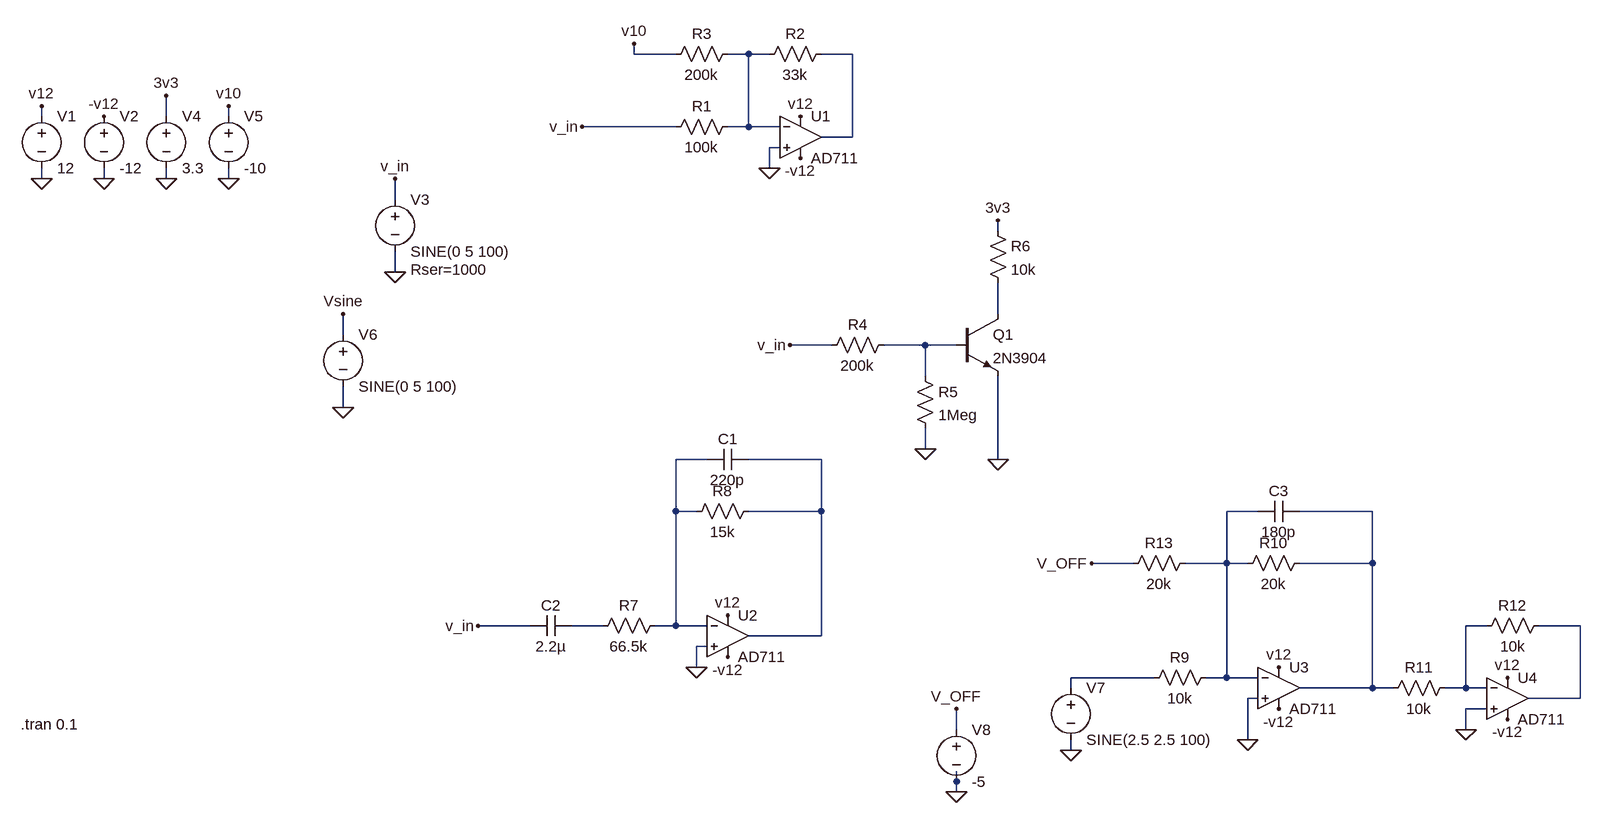
[diagram p0: schematic Interface.asc]
Interface.asc, the LTspice schematic file:
Version 4.1
SHEET 1 1508 1188
WIRE 48 32 48 16
WIRE 112 32 48 32
WIRE 224 32 192 32
WIRE 256 32 224 32
WIRE 384 32 336 32
WIRE -864 128 -864 112
WIRE -672 128 -672 96
WIRE -576 128 -576 112
WIRE 112 144 -32 144
WIRE 224 144 224 32
WIRE 224 144 192 144
WIRE 272 144 224 144
WIRE 384 160 384 32
WIRE 384 160 336 160
WIRE 272 176 256 176
WIRE 256 208 256 176
WIRE -864 224 -864 208
WIRE -768 224 -768 208
WIRE -672 224 -672 208
WIRE -576 224 -576 208
WIRE -320 256 -320 224
WIRE 608 304 608 288
WIRE -320 368 -320 336
WIRE 608 432 608 384
WIRE -400 464 -400 432
WIRE 352 480 288 480
WIRE 496 480 432 480
WIRE 544 480 496 480
WIRE 496 528 496 480
WIRE -400 576 -400 544
WIRE 496 640 496 608
WIRE 160 656 112 656
WIRE 336 656 224 656
WIRE 608 656 608 528
WIRE 112 736 112 656
WIRE 144 736 112 736
WIRE 336 736 336 656
WIRE 336 736 224 736
WIRE 1008 736 960 736
WIRE 1184 736 1072 736
WIRE 816 816 752 816
WIRE 960 816 960 736
WIRE 960 816 896 816
WIRE 992 816 960 816
WIRE 1184 816 1184 736
WIRE 1184 816 1072 816
WIRE -112 912 -192 912
WIRE 0 912 -48 912
WIRE 112 912 112 736
WIRE 112 912 80 912
WIRE 160 912 112 912
WIRE 1360 912 1328 912
WIRE 1504 912 1440 912
WIRE 336 928 336 736
WIRE 336 928 224 928
WIRE 160 944 144 944
WIRE 144 976 144 944
WIRE 848 992 720 992
WIRE 960 992 960 816
WIRE 960 992 928 992
WIRE 1008 992 960 992
WIRE 720 1008 720 992
WIRE 1184 1008 1184 816
WIRE 1184 1008 1072 1008
WIRE 1216 1008 1184 1008
WIRE 1328 1008 1328 912
WIRE 1328 1008 1296 1008
WIRE 1360 1008 1328 1008
WIRE 1008 1024 992 1024
WIRE 1504 1024 1504 912
WIRE 1504 1024 1424 1024
WIRE 1360 1040 1328 1040
WIRE 544 1072 544 1040
WIRE 1328 1072 1328 1040
WIRE 992 1088 992 1024
WIRE 720 1104 720 1088
WIRE 544 1152 544 1136
WIRE 544 1168 544 1152
FLAG -864 224 0
FLAG -768 224 0
FLAG -320 368 0
FLAG -864 112 v12
FLAG 304 128 v12
FLAG -768 128 -v12
FLAG 304 192 -v12
FLAG -672 224 0
FLAG -672 96 3v3
FLAG 608 288 3v3
FLAG 256 208 0
FLAG -576 224 0
FLAG -576 112 v10
FLAG 48 16 v10
FLAG -320 224 v_in
FLAG -32 144 v_in
FLAG 496 640 0
FLAG 608 656 0
FLAG 288 480 v_in
FLAG 192 896 v12
FLAG 192 960 -v12
FLAG 144 976 0
FLAG -192 912 v_in
FLAG -400 576 0
FLAG -400 432 Vsine
FLAG 1040 976 v12
FLAG 1040 1040 -v12
FLAG 720 1104 0
FLAG 1392 992 v12
FLAG 1392 1056 -v12
FLAG 1328 1072 0
FLAG 544 1168 0
FLAG 544 1040 V_OFF
FLAG 992 1088 0
FLAG 752 816 V_OFF
SYMBOL OpAmps\\AD711 304 96 R0
SYMATTR InstName U1
SYMBOL npn 544 432 R0
SYMATTR InstName Q1
SYMATTR Value 2N3904
SYMBOL res 208 128 R90
WINDOW 0 0 56 VBottom 2
WINDOW 3 32 56 VTop 2
SYMATTR InstName R1
SYMATTR Value 100k
SYMBOL res 352 16 R90
WINDOW 0 0 56 VBottom 2
WINDOW 3 32 56 VTop 2
SYMATTR InstName R2
SYMATTR Value 33k
SYMBOL res 208 16 R90
WINDOW 0 0 56 VBottom 2
WINDOW 3 32 56 VTop 2
SYMATTR InstName R3
SYMATTR Value 200k
SYMBOL voltage -864 112 R0
WINDOW 123 0 0 Left 0
WINDOW 39 0 0 Left 0
SYMATTR InstName V1
SYMATTR Value 12
SYMBOL voltage -768 112 R0
WINDOW 123 0 0 Left 0
WINDOW 39 0 0 Left 0
SYMATTR InstName V2
SYMATTR Value -12
SYMBOL voltage -320 240 R0
WINDOW 123 0 0 Left 0
WINDOW 39 24 124 Left 2
SYMATTR SpiceLine Rser=1000
SYMATTR InstName V3
SYMATTR Value SINE(0 5 100)
SYMBOL voltage -672 112 R0
WINDOW 123 0 0 Left 0
WINDOW 39 0 0 Left 0
SYMATTR InstName V4
SYMATTR Value 3.3
SYMBOL voltage -576 112 R0
WINDOW 123 0 0 Left 0
WINDOW 39 0 0 Left 0
SYMATTR InstName V5
SYMATTR Value -10
SYMBOL res 448 464 R90
WINDOW 0 0 56 VBottom 2
WINDOW 3 32 56 VTop 2
SYMATTR InstName R4
SYMATTR Value 200k
SYMBOL res 480 512 R0
SYMATTR InstName R5
SYMATTR Value 1Meg
SYMBOL res 592 288 R0
SYMATTR InstName R6
SYMATTR Value 10k
SYMBOL OpAmps\\AD711 192 864 R0
SYMATTR InstName U2
SYMBOL res 96 896 R90
WINDOW 0 0 56 VBottom 2
WINDOW 3 32 56 VTop 2
SYMATTR InstName R7
SYMATTR Value 66.5k
SYMBOL res 240 720 R90
WINDOW 0 0 56 VBottom 2
WINDOW 3 32 56 VTop 2
SYMATTR InstName R8
SYMATTR Value 15k
SYMBOL cap 224 640 R90
WINDOW 0 0 32 VBottom 2
WINDOW 3 32 32 VTop 2
SYMATTR InstName C1
SYMATTR Value 220p
SYMBOL cap -48 896 R90
WINDOW 0 0 32 VBottom 2
WINDOW 3 32 32 VTop 2
SYMATTR InstName C2
SYMATTR Value 2.2µ
SYMBOL voltage -400 448 R0
WINDOW 123 0 0 Left 0
WINDOW 39 0 0 Left 0
SYMATTR InstName V6
SYMATTR Value SINE(0 5 100)
SYMBOL OpAmps\\AD711 1040 944 R0
SYMATTR InstName U3
SYMBOL res 944 976 R90
WINDOW 0 0 56 VBottom 2
WINDOW 3 32 56 VTop 2
SYMATTR InstName R9
SYMATTR Value 10k
SYMBOL res 1088 800 R90
WINDOW 0 0 56 VBottom 2
WINDOW 3 32 56 VTop 2
SYMATTR InstName R10
SYMATTR Value 20k
SYMBOL cap 1072 720 R90
WINDOW 0 0 32 VBottom 2
WINDOW 3 32 32 VTop 2
SYMATTR InstName C3
SYMATTR Value 180p
SYMBOL voltage 720 992 R0
WINDOW 123 0 0 Left 0
WINDOW 39 0 0 Left 0
SYMATTR InstName V7
SYMATTR Value SINE(2.5 2.5 100)
SYMBOL OpAmps\\AD711 1392 960 R0
SYMATTR InstName U4
SYMBOL res 1312 992 R90
WINDOW 0 0 56 VBottom 2
WINDOW 3 32 56 VTop 2
SYMATTR InstName R11
SYMATTR Value 10k
SYMBOL res 1456 896 R90
WINDOW 0 0 56 VBottom 2
WINDOW 3 32 56 VTop 2
SYMATTR InstName R12
SYMATTR Value 10k
SYMBOL voltage 544 1056 R0
WINDOW 123 0 0 Left 0
WINDOW 39 0 0 Left 0
SYMATTR InstName V8
SYMATTR Value -5
SYMBOL res 912 800 R90
WINDOW 0 0 56 VBottom 2
WINDOW 3 32 56 VTop 2
SYMATTR InstName R13
SYMATTR Value 20k
TEXT -896 1064 Left 2 !.tran 0.1

The netlist it stands for:
* Interface.asc
X§U1 0 N001 v12 -v12 N002 AD712  ; AD711, pins In+ In- V+ V- OUT
Q1 N003 N004 0 0 2N3904
R1 N001 v_in 100k
R2 N002 N001 33k
R3 N001 v10 200k
V1 v12 0 12
V2 -v12 0 -12
V3 v_in 0 SINE(0 5 100) Rser=1000
V4 3v3 0 3.3
V5 v10 0 -10
R4 N004 v_in 200k
R5 N004 0 1Meg
R6 3v3 N003 10k
X§U2 0 N005 v12 -v12 N006 AD712  ; AD711, pins In+ In- V+ V- OUT
R7 N005 N009 66.5k
R8 N006 N005 15k
C1 N006 N005 220p
C2 N009 v_in 2.2µ
V6 Vsine 0 SINE(0 5 100)
X§U3 0 N007 v12 -v12 N008 AD712  ; AD711, pins In+ In- V+ V- OUT
R9 N007 N012 10k
R10 N008 N007 20k
C3 N008 N007 180p
V7 N012 0 SINE(2.5 2.5 100)
X§U4 0 N010 v12 -v12 N011 AD712  ; AD711, pins In+ In- V+ V- OUT
R11 N010 N008 10k
R12 N011 N010 10k
V8 V_OFF 0 -5
R13 N007 V_OFF 20k
.model NPN NPN
.model PNP PNP
.lib standard.bjt
.tran 0.1
.lib ADI1.lib
.backanno
.end